# Altium schematic sheet 15_CAN_BUS.SchDoc: =TitleParameter
size A3; Address: Crete IL; Organization: ASISGUARD; Address1: Kemalpasa, Kemalpasa Cd. No:290 D:292H, 35060 Bornova/Izmir/Turkey
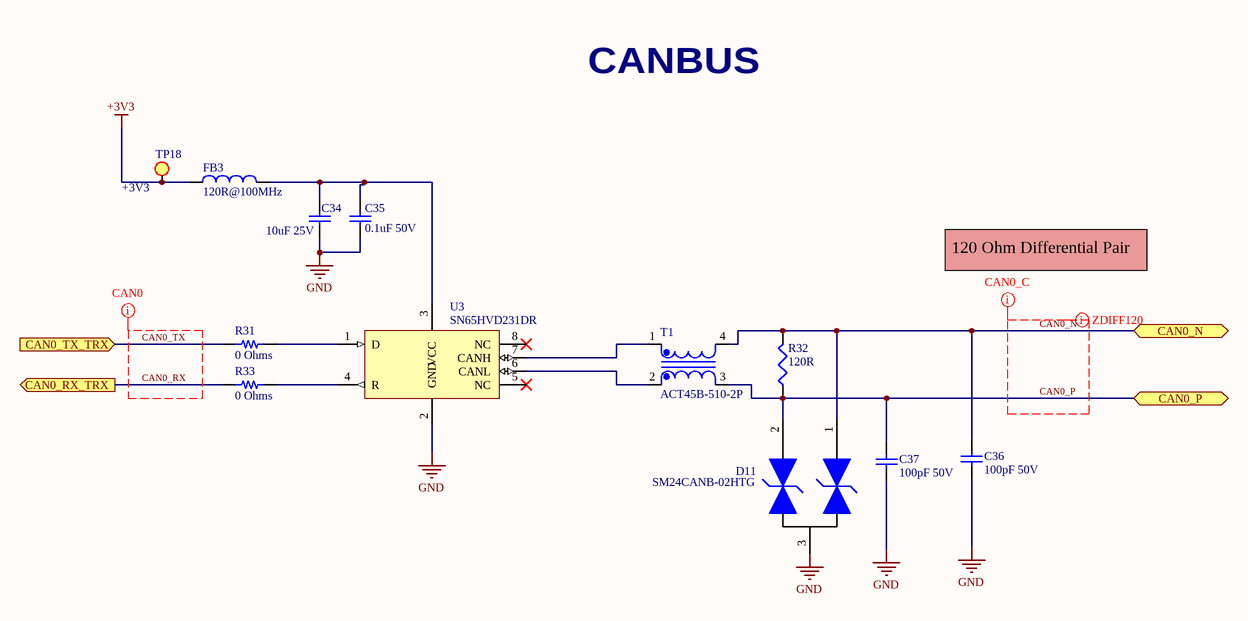
[diagram p0: 15_CAN_BUS.SchDoc]

## Parts
C34  value 10uF 25V  [SMC0805]  (hidden comment: CAP CER 10UF 25V X5R 0805)
C35  value 0.1uF 50V  [SMC0603]  (hidden comment: CAP CER 0.1UF 50V X7R 0603)
C36  value 100pF 50V  [SMC0603]  (hidden comment: CAP CER 100PF 50V C0G/NP0 0603)
C37  value 100pF 50V  [SMC0603]  (hidden comment: CAP CER 100PF 50V C0G/NP0 0603)
D11  Manufacturer Part Number: SM24CANB-02HTG  [SOT23_3-DIODE]  (hidden comment: CAN)
FB3  value 120R@100MHz  [FB 0603(1608)]  (hidden comment: FERRITE BEAD 120 OHM 0603 1LN)
R31  0 Ohms  [RES 0402_1005]
R32  value 120R  [RES1206]  (hidden comment: RES SMD 120 OHM 1% 1/4W 1206)
R33  0 Ohms  [RES 0402_1005]
T1  ACT45B-510-2P  [TDK_ACT45B-510-2P-TL003_0]
TP18  +3V3  [TEST_POINT]
U3  IC TRANSCEIVER HALF 1/1 8SOIC  [SOIC8 - duplicate]  (value not drawn)

## Ports
CAN0_N (bidir), CAN0_P (bidir), CAN0_RX_TRX (out), CAN0_TX_TRX (in)

## Nets
+3V3: FB3.1 TP18.1(TP)
GND: C34.1 C35.1 C36.1 C37.1 D11.3 U3.2(GND)
CAN0_N: C36.2 D11.1 R32.2 T1.4 ; port CAN0_N
CAN0_P: C37.2 D11.2 R32.1 T1.3 ; port CAN0_P
CAN0_RX: R33.2 ; port CAN0_RX_TRX
CAN0_TX: R31.2 ; port CAN0_TX_TRX
NetC34_2: C34.2 C35.2 FB3.2 U3.3(VCC)
NetR31_1: R31.1 U3.1(D)
NetR33_1: R33.1 U3.4(R)
NetT1_1: T1.1 U3.7(CANH)
NetT1_2: T1.2 U3.6(CANL)

Not connected (* = marked no-connect by the designer): U3 5(NC)* 8(NC)*

## Layout directives
differential pair; differential pair class ZDIFF120: CAN0_N, CAN0_P
net class CAN0_C: CAN0_N, CAN0_P
net class CAN0: CAN0_RX, CAN0_TX

## Notes on the sheet
- CANBUS
- 120 Ohm Differential Pair
- Proje/Project:
- Sayfa Adı/Document Name:
- Çizilme Tarihi/Drawing Date
- Umit KAYACIK
- Tasarlayan/Designed By
- Sayfa/Sheet:
- Revision:
- of
- Son Güncelleme/Last Edit Date
- Kontrol eden/Checked By
- Onaylayan/Approved By
- Boyut/Size:
- Varyant/Variant:
- Dil/Language:
- A3
- ENG

## Library data of the parts
C34 = CAP0805_10UF_25V: 10 µF ±10% 25V Ceramic Capacitor X5R 0805 (2012 Metric); Manufacturer Part Number: CL21A106KAYNNNE; Order Code: DIGI: 1276-2891-2-ND; Sirius Stock Code: *; LCSC Manufacturer Part Number: CL21A106KAYNNNE; LCSC Part Number: C15850
C35 = CAP0603_0.1UF_50V: 0.1 µF ±10% 50V Ceramic Capacitor X7R 0603 (1608 Metric); Manufacturer Part Number: CL10B104KB8NNNL; LCSC Manufacturer Part Number: CL10B104KB8NNNC; Order Code: DIGI:1276-CL10B104KB8NNNLTR-ND; Sirius Stock Code: A063-AGC10300001226; LCSC Part Number: C1591
C36 C37 = CAP0603_100PF_50V: 100 pF ±5% 50V Ceramic Capacitor C0G, NP0 0603 (1608 Metric); Manufacturer Part Number: 06035A101JAT2A; LCSC Manufacturer Part Number: CC0603JRNPO9BN101; Order Code: DIGI: 478-1175-2-ND; Sirius Stock Code: *; LCSC Part Number: C14665
D11 = SM24CANB-02HTG_TVS: TVS DIODE 24VWM 50VC SOT23-3; Order Code: DIGI : F6707CT-ND; Value: 2Ch; LCSC Manufacturer Part Number: SM24CANB-02HTG; LCSC Part Number: C151237
FB3 = FB0603_120R@100MHz: 120 Ohms @ 100 MHz 1 Power Line Ferrite Bead 0603 (1608 Metric) 3A 30mOhm; Manufacturer Part Number: BLM18KG121TH1D; Order Code: Digi:490-13261-2-ND; LCSC Manufacturer Part Number: BLM18KG121TH1D; LCSC Part Number: C437404
R31 R33 = HCJ0402ZT0R00: RES 0 OHM JUMPER 1/8W 0402; Manufacturer: Stackpole Electronics Inc; Power (Watts): 0.125W, 1/8W; Part Number: HCJ0402ZT0R00; Value: 0 Ohms; ComponentLink1Description: Datasheet; ComponentLink1URL: https://www.seielect.com/catalog/sei-hcj.pdf; ComponentLink2Description: DigiKey Link; ComponentLink2URL: https://www.digikey.com/en/products/detail/stackpole-electronics-inc/HCJ0402ZT0R00/4357659; Composition: Metal Foil; Device Package: 0402 (1005 Metric); Features: Automotive AEC-Q200; Height - Seated (Max): 0.018" (0.45mm); LastUpdated: 2/9/2024 8:29:49 PM; Lifecycle Status: Active; Minimum Order: 1; Number of Terminations: 2; Operating Temperature: -55°C ~ 155°C; Package / Case: 0402 (1005 Metric); Packaging: TapeAndReel; PartId: 12327; Part Status: Active; Price: 0.07; Ratings: AEC-Q200; Resistance: 0 Ohms; Series: HCJ; Size / Dimension: 0.039" L x 0.020" W (1.00mm x 0.50mm); Supplier 1: DigiKey; Supplier Part Number 1: HCJ0402ZT0R00CT-ND; Supplier Device Package: 0402; Tolerance: Jumper
R32 = RES1206_120R_%1: 120 Ohms ±1% 0.25W, 1/4W Chip Resistor 1206 (3216 Metric) Automotive AEC-Q200, Moisture Resistant Thick Film; Manufacturer Part Number: AC1206FR-07120RL; Order Code: Digi: YAG3810TR-ND; Sirius Stock Code: *; LCSC Manufacturer Part Number: AC1206FR-07120RL; LCSC Part Number: C229293
T1 = ACT45B-510-2P: Ind Common Mode Filter Wirewound 51uH 2KOhm -30% to 50% 100KHz 200mA 1812 T/R; Manufacturer: TDK; Manufacturer Part Number: ACT45B-510-2P-TL003; Core Material: Ferrite; Impedance: 2.8kR; DC Resistance (DCR): 1R; Number of Lines: 2; Voltage Rating (DC): 50V; Test Frequency: 10MHz; Insulation Resistance: 10MR; Element Configuration: Dual; Supplier 1: Digi-Key; Supplier Part Number 1: 445-3958-1-ND; RoHS: Yes; Category: Fixed Inductors; Stock 1: 75821; Pricing 1: 1=1,95000, 10=1,80000, 25=1,65000, 50=1,41000, 100=1,26000, 250=1,08000, 500=1,02000, 1000=0,93000 (USD); Mount: Surface Mount; Case/Package: 1812; Number of Pins: 4; Case Code (Imperial): 1812; Min Operating Temperature: -40°C; Max Operating Temperature: 150°C; Inductance: 51uH; Packaging: Tape and Reel; Package Quantity: 2000; Tolerance: 50%; Current Rating: 200mA; Max DC Current: 200mA; Current: 200mA; Voltage Rating: 50V; Termination: SMD/SMT; DC Current: 200mA; Self Resonant Frequency: 10MHz; Length: 4.7mm; Width: 3.2mm; Height: 2.8mm; Depth: 3.4mm; Radiation Hardening: No; REACH SVHC: No SVHC; Lead Free: Lead Free; Military Standard: Not; ComponentLink1URL: https://datasheet.ciiva.com/22726/1649098-22726290.pdf?src-supplier=Element14; ComponentLink1Description: https://datasheet.ciiva.com/22726/1649098-22726290.pdf?src-supplier=Element14; ComponentLink2URL: https://datasheet.ciiva.com/26793/act45b-510-2p-tl003-26793344.pdf?src-supplier=IIIC; ComponentLink2Description: https://datasheet.ciiva.com/26793/act45b-510-2p-tl003-26793344.pdf?src-supplier=IIIC; ComponentLink3URL: https://datasheet.ciiva.com/8498/e9711-act-8498633.pdf?src-supplier=Avnet; ComponentLink3Description: https://datasheet.ciiva.com/8498/e9711-act-8498633.pdf?src-supplier=Avnet; ComponentLink4URL: https://datasheet.ciiva.com/1007/e9711-act-1007931.pdf?src-supplier=Digi-Key; ComponentLink4Description: https://datasheet.ciiva.com/1007/e9711-act-1007931.pdf?src-supplier=Digi-Key; ComponentLink5URL: https://datasheet.ciiva.com/15191/getdatasheetpartid-349822-15191803.pdf?src-supplier=Verical; ComponentLink5Description: https://datasheet.ciiva.com/15191/getdatasheetpartid-349822-15191803.pdf?src-supplier=Verical; ComponentLink6URL: https://datasheet.ciiva.com/1007/e9711-act-1007932.pdf?src-supplier=Digi-Key; ComponentLink6Description: https://datasheet.ciiva.com/1007/e9711-act-1007932.pdf?src-supplier=Digi-Key; ComponentLink7URL: https://datasheet.ciiva.com/1007/e9711-act-1007933.pdf?src-supplier=Digi-Key; ComponentLink7Description: https://datasheet.ciiva.com/1007/e9711-act-1007933.pdf?src-supplier=Digi-Key; ComponentLink8URL: https://datasheet.ciiva.com/7649/1833202-7649183.pdf?src-supplier=Element14; ComponentLink8Description: https://datasheet.ciiva.com/7649/1833202-7649183.pdf?src-supplier=Element14; LCSC Manufacturer Part Number: ACT45B-510-2P-TL003; LCSC Part Number: C76584
TP18 = TP_1
U3 = SN65HVD231DR: 1/1 Transceiver Half CANbus 8-SOIC; Order Code: DIGI : 296-26343-2-ND; Value: CAN; LCSC Manufacturer Part Number: SN65HVD231DR; LCSC Part Number: C129257; P/N: SN65HVD231DR